# EAGLE design untitled (EAGLE 8.7.1)
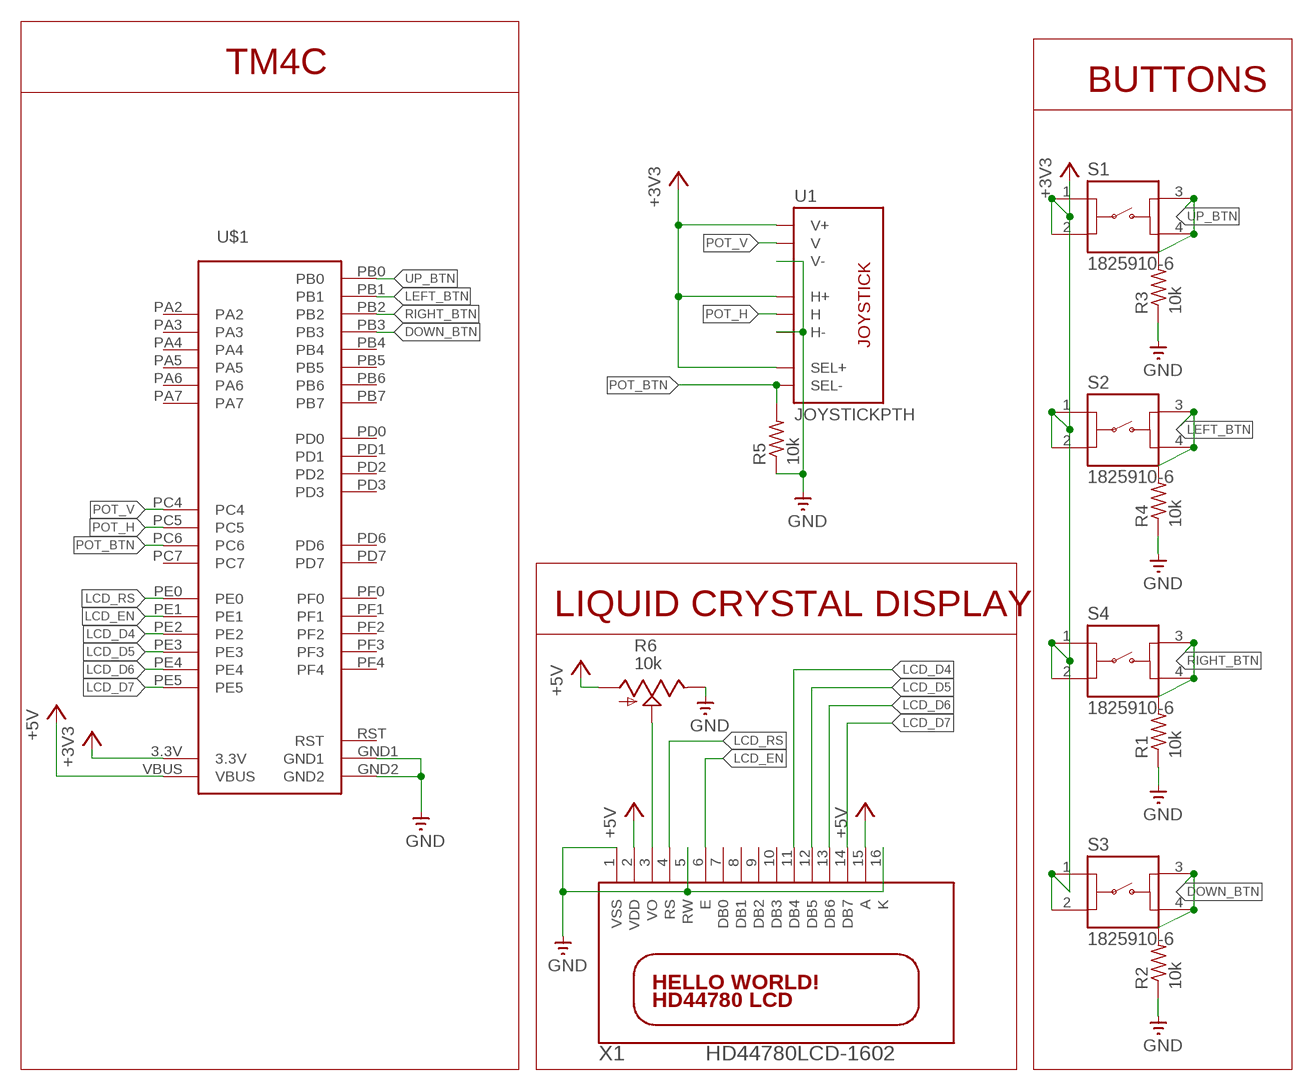
[diagram p0: schematic, sheet 1]

## Parts
R1  10k  R-US_R0805  [R0805]
R2  10k  R-US_R0805  [R0805]
R3  10k  R-US_R0805  [R0805]
R4  10k  R-US_R0805  [R0805]
R5  10k  R-US_R0805  [R0805]
R6  10k  TRIM_US-S64W  [S64W]
S1  1825910-6  [1825910-6]
S2  1825910-6  [1825910-6]
S3  1825910-6  [1825910-6]
S4  1825910-6  [1825910-6]
U1  JOYSTICKPTH  [JOYSTICK]
U$1  STELLARIS-LAUNCHPADSTELLARIS-LAUNCHPAD  [LAUNCHPAD-XL]
X1  HD44780LCD-1602  [LCD1602]

## Nets
+3V3: S1.1 S1.2 S2.1 S2.2 S3.1 S3.2 S4.1 S4.2 U1.B1A(SEL+) U1.H1(H+) U1.V1(V+) U$1.3.3V
+5V: R6.A U$1.VBUS X1.2(VDD) X1.15(A)
DOWN_BTN: R2.2 S3.3 S3.4 U$1.PB3
GND: R1.1 R2.1 R3.1 R4.1 R5.1 R6.E U1.H3(H-) U1.V3(V-) U$1.GND1 U$1.GND2 X1.1(VSS) X1.5(RW) X1.16(K)
LCD_D4: U$1.PE2 X1.11(DB4)
LCD_D5: U$1.PE3 X1.12(DB5)
LCD_D6: U$1.PE4 X1.13(DB6)
LCD_D7: U$1.PE5 X1.14(DB7)
LCD_EN: U$1.PE1 X1.6(E)
LCD_RS: U$1.PE0 X1.4(RS)
LEFT_BTN: R4.2 S2.3 S2.4 U$1.PB1
N$5: R6.S X1.3(VO)
POT_BTN: R5.2 U1.B2A(SEL-) U$1.PC6
POT_H: U1.H2(H) U$1.PC5
POT_V: U1.V2(V) U$1.PC4
RIGHT_BTN: R1.2 S4.3 S4.4 U$1.PB2
UP_BTN: R3.2 S1.3 S1.4 U$1.PB0
Unconnected: U$1.PA2 U$1.PA3 U$1.PA4 U$1.PA5 U$1.PA6 U$1.PA7 U$1.PB4 U$1.PB5 U$1.PB6 U$1.PB7 U$1.PC7 U$1.PD0 U$1.PD1 U$1.PD2 U$1.PD3 U$1.PD6 U$1.PD7 U$1.PF0 U$1.PF1 U$1.PF2 U$1.PF3 U$1.PF4 X1.7(DB0) X1.8(DB1) X1.9(DB2) X1.10(DB3)

## Notes on the sheet
- TM4C
- BUTTONS
- LIQUID CRYSTAL DISPLAY

## Power pins joined to a net without a drawn wire
RST: U$1.RST

## Library data of the parts
R1-R5 = adafruit:R-US_: RESISTOR, American symbol
R6 = pot:TRIM_US-: POTENTIOMETER
S1-S4 = Switch:1825910-6: SWITCH TACTILE SPST-NO 0.05A 24V Manufacturer's datasheet <https://www.te.com/commerce/DocumentDelivery/DDEController?Action=srchrtrv&DocNm=1825910&DocType=Customer+Drawing&DocLang=English>; CREATED_BY: PCBLayout.com; DIGIKEY_PART_NUMBER: 450-1650-ND; MANUFACTURER: TE Connectivity ALCOSWITCH Switches; MPN: 1825910-6
U1 = adafruit:JOYSTICK: Thumb Joystick Joystick commonly found in PS2 controllers. Two pots and a select switch. Adapted from Sparkfun Library (but for more common 6mm switch sticks)
U$1 = fabhack:STELLARIS-LAUNCHPAD: Stellaris Launchpad LM4F120 using all header pins to connect to XL booster packs.
X1 = adafruit:HD44780LCD: HD44780 LCD Standard character type LCDs, available in sizes from 8x1 to 40x4!; SPICEPREFIX: X

## Board
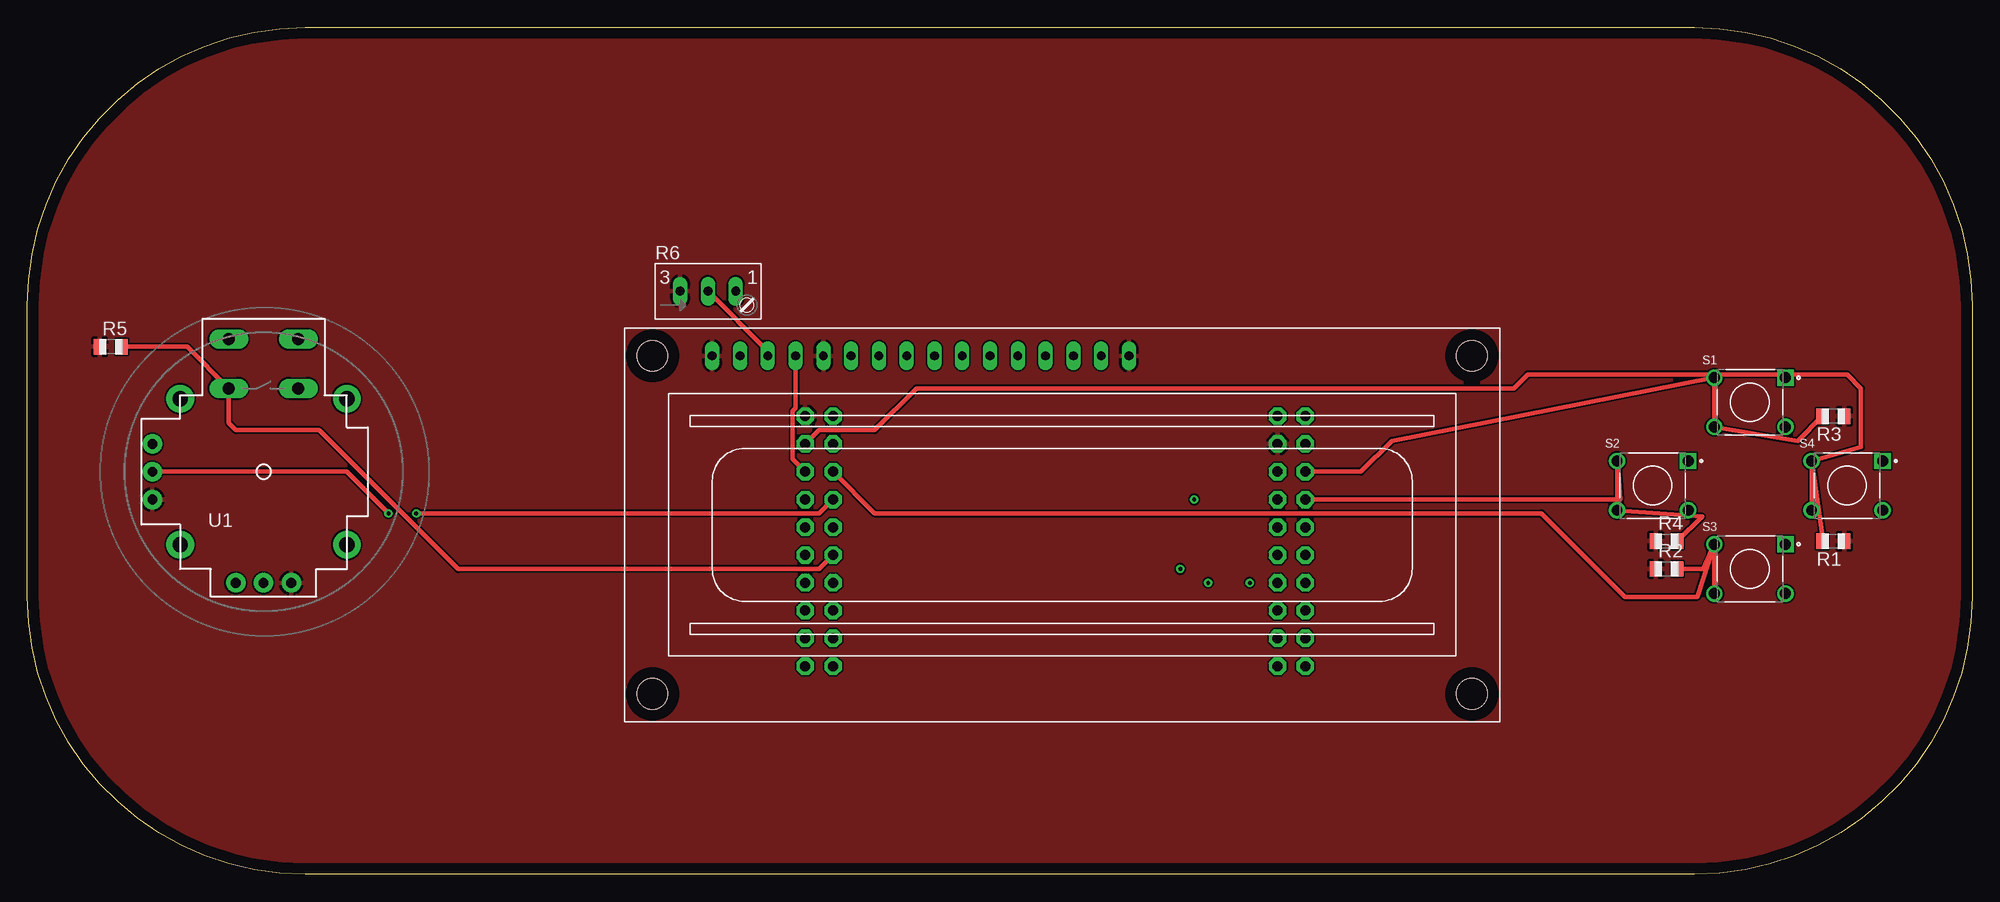
[diagram p1: board, top side]
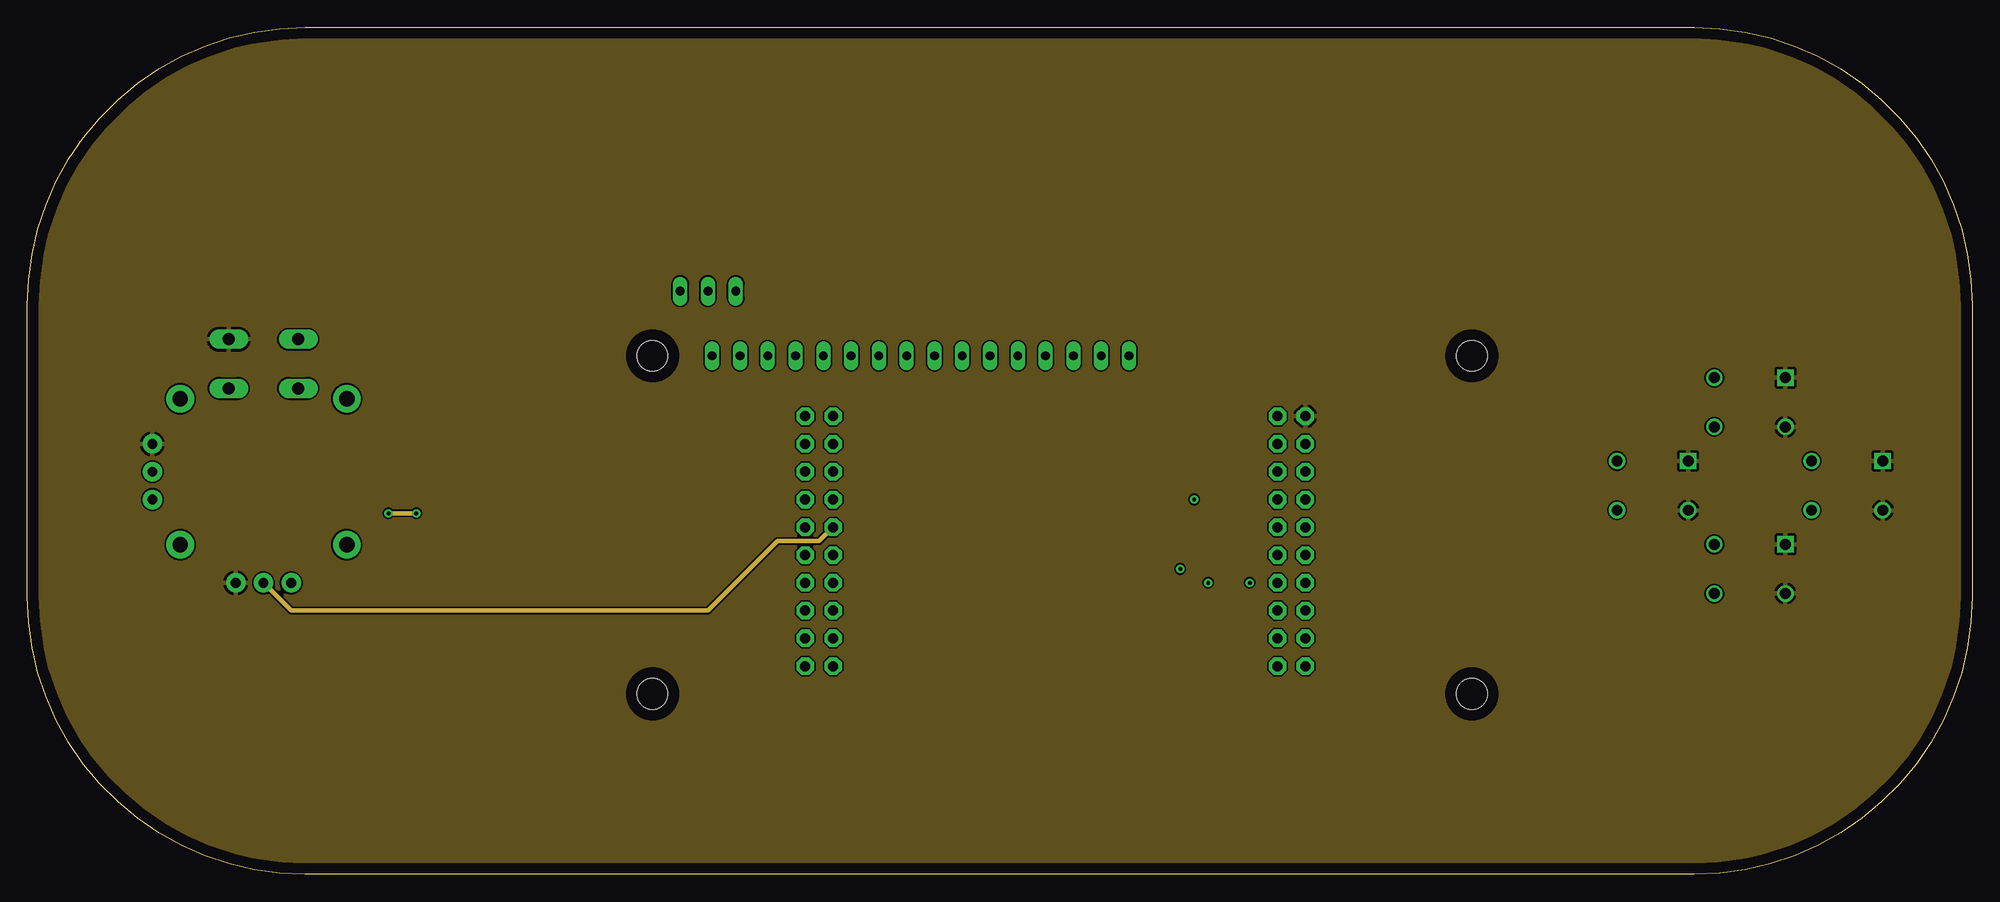
[diagram p2: board, inner layer Route2]
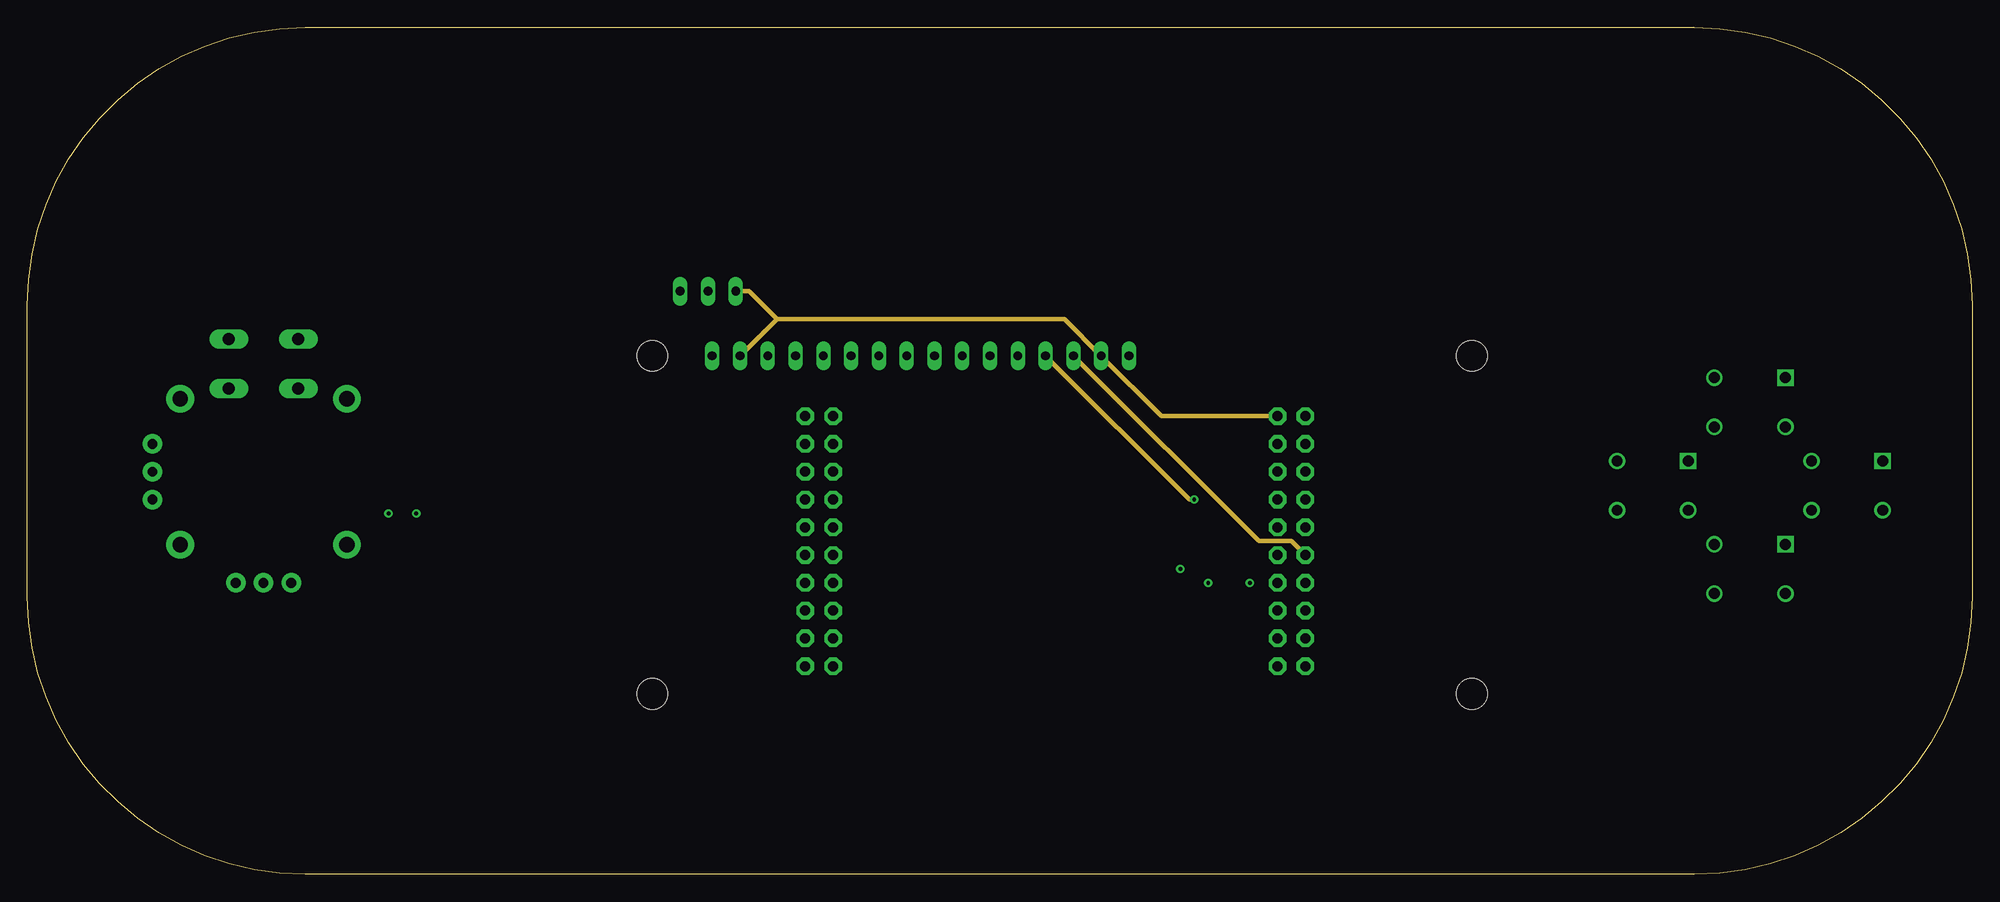
[diagram p3: board, inner layer Route3]
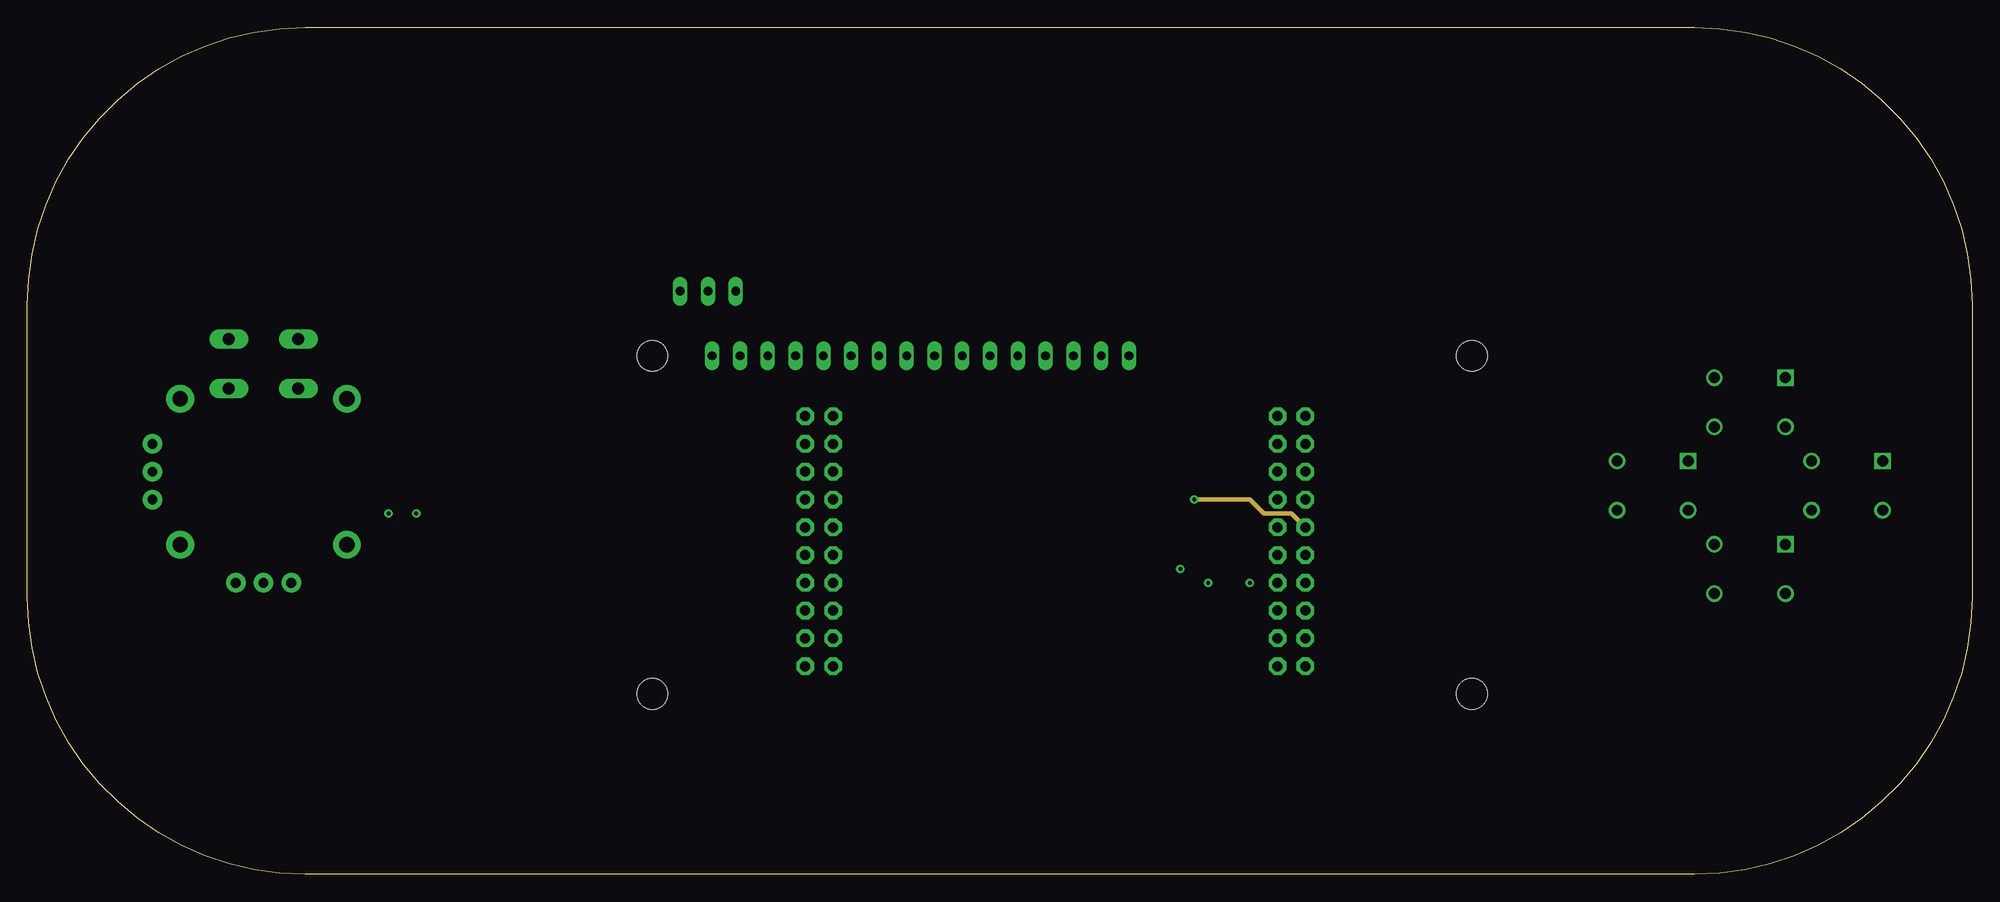
[diagram p4: board, inner layer Route4]
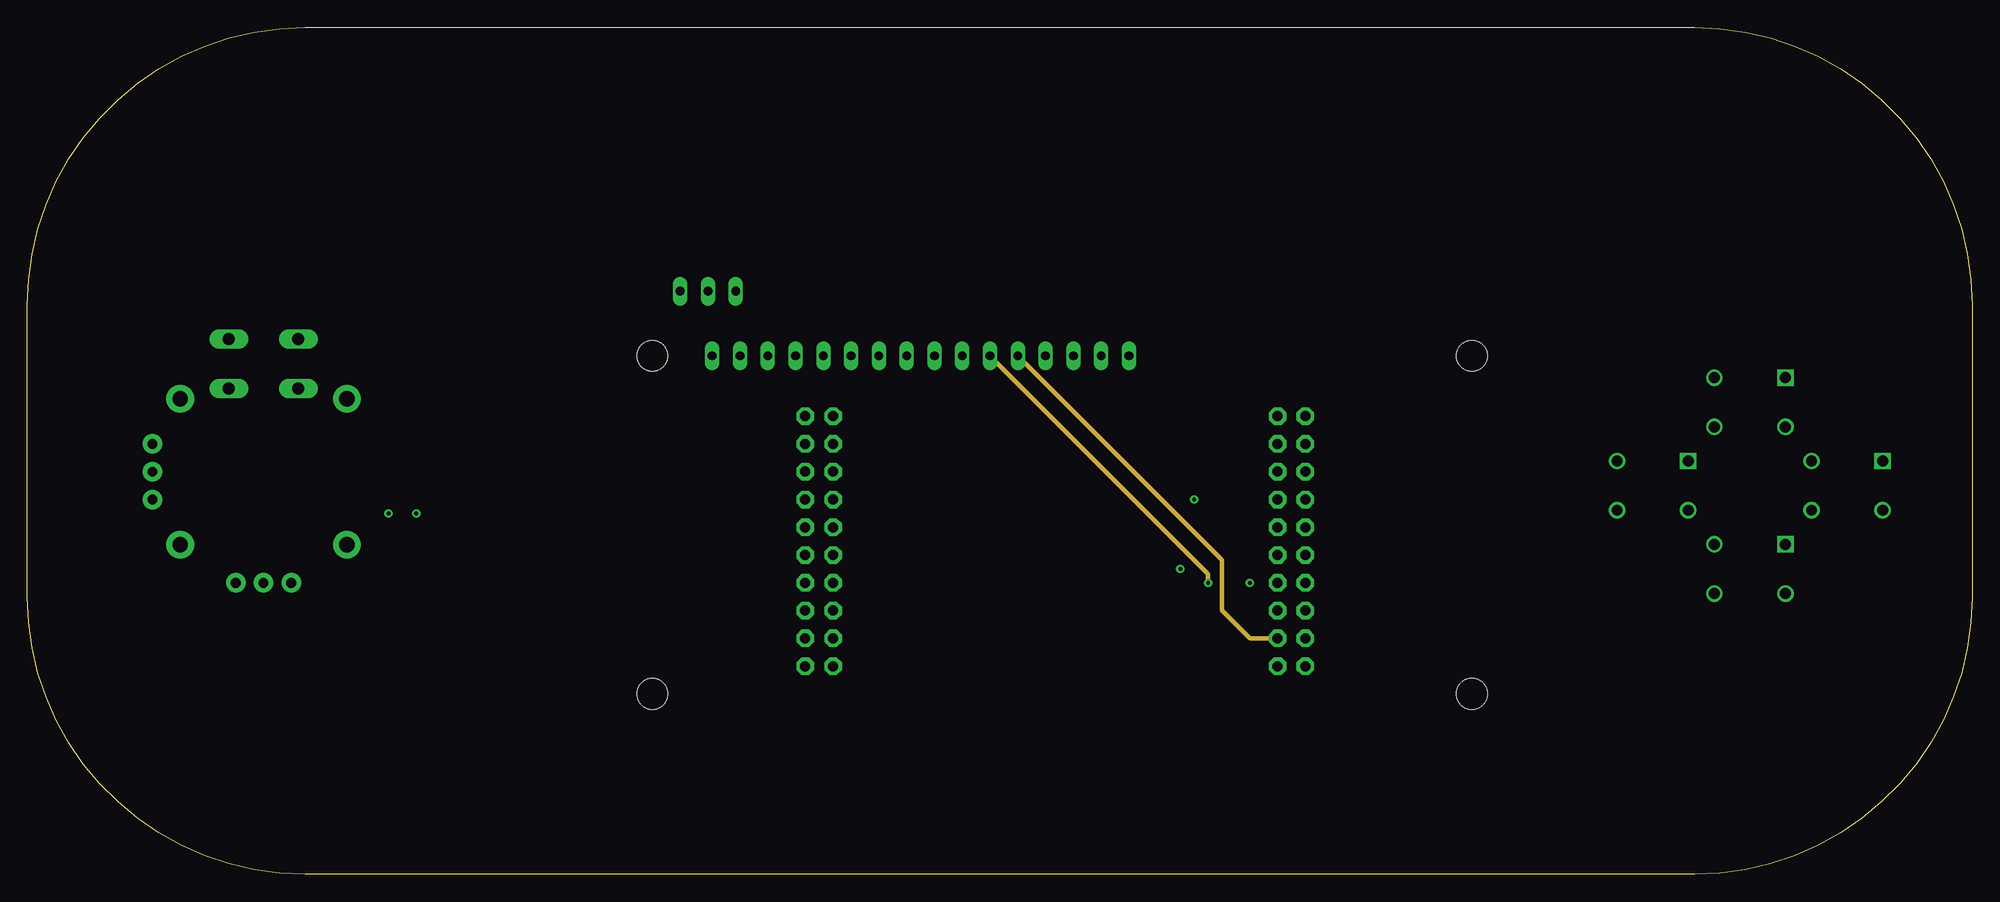
[diagram p5: board, inner layer Route5]
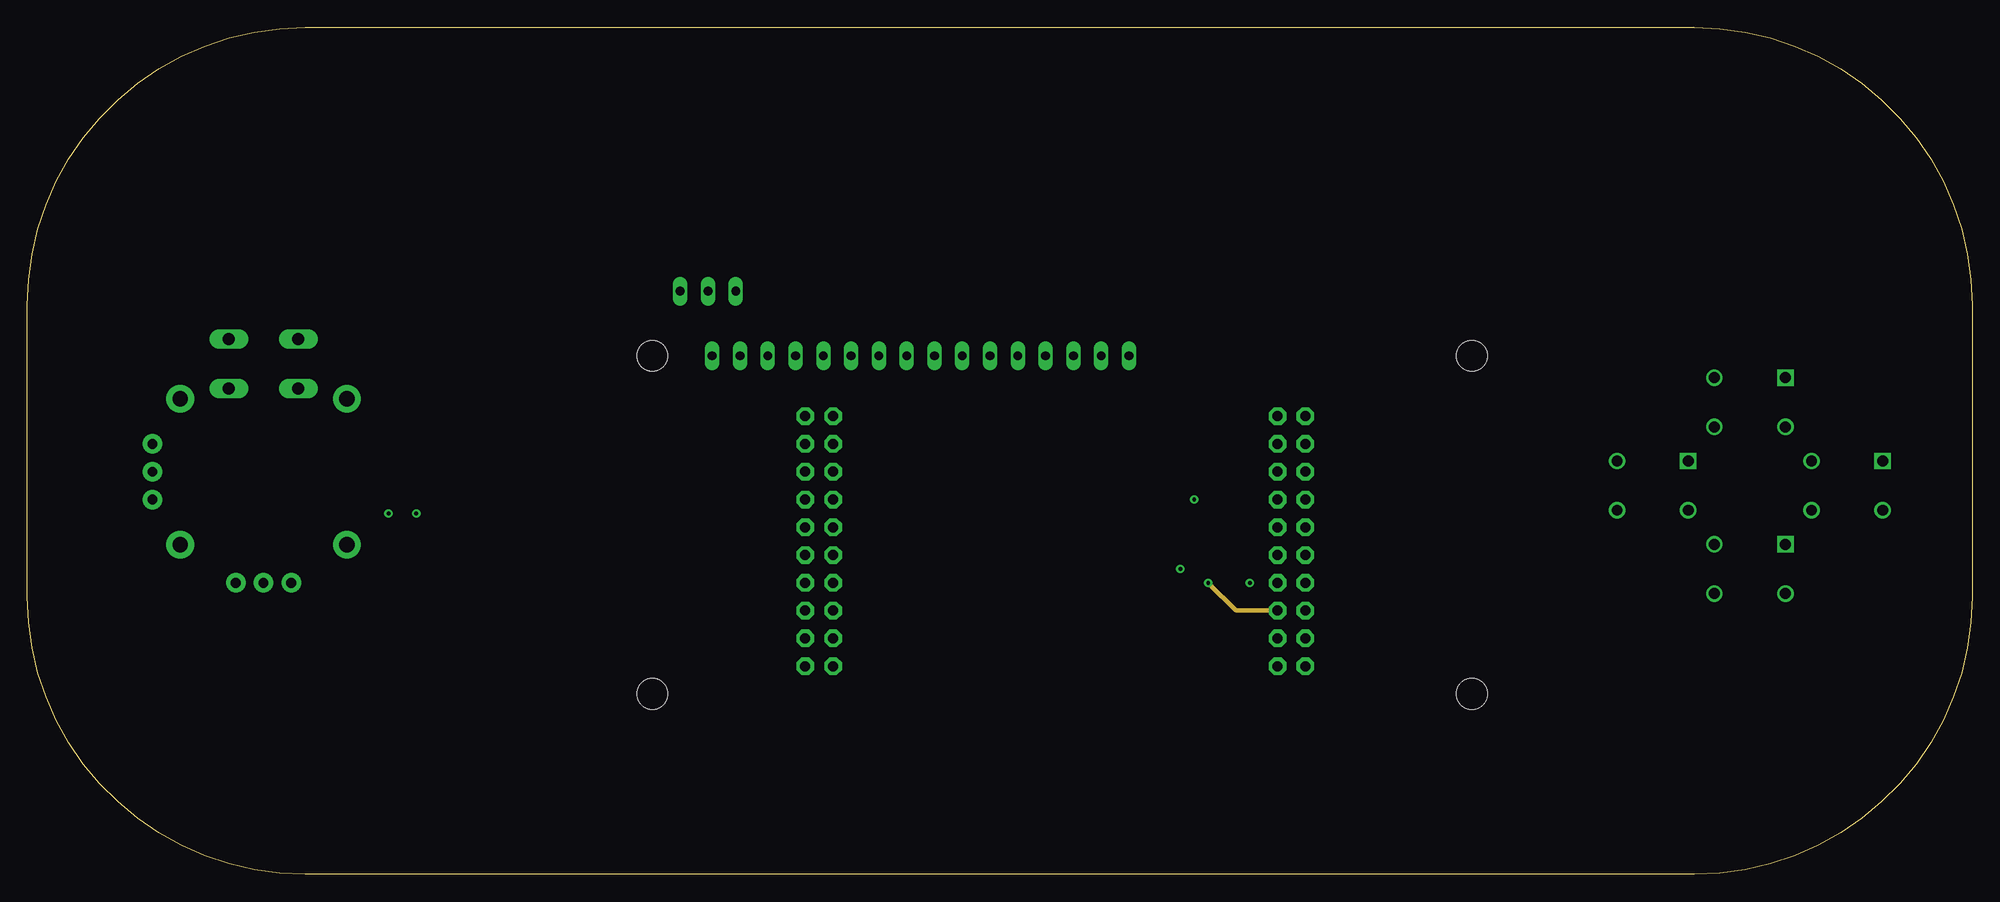
[diagram p6: board, inner layer Route6]
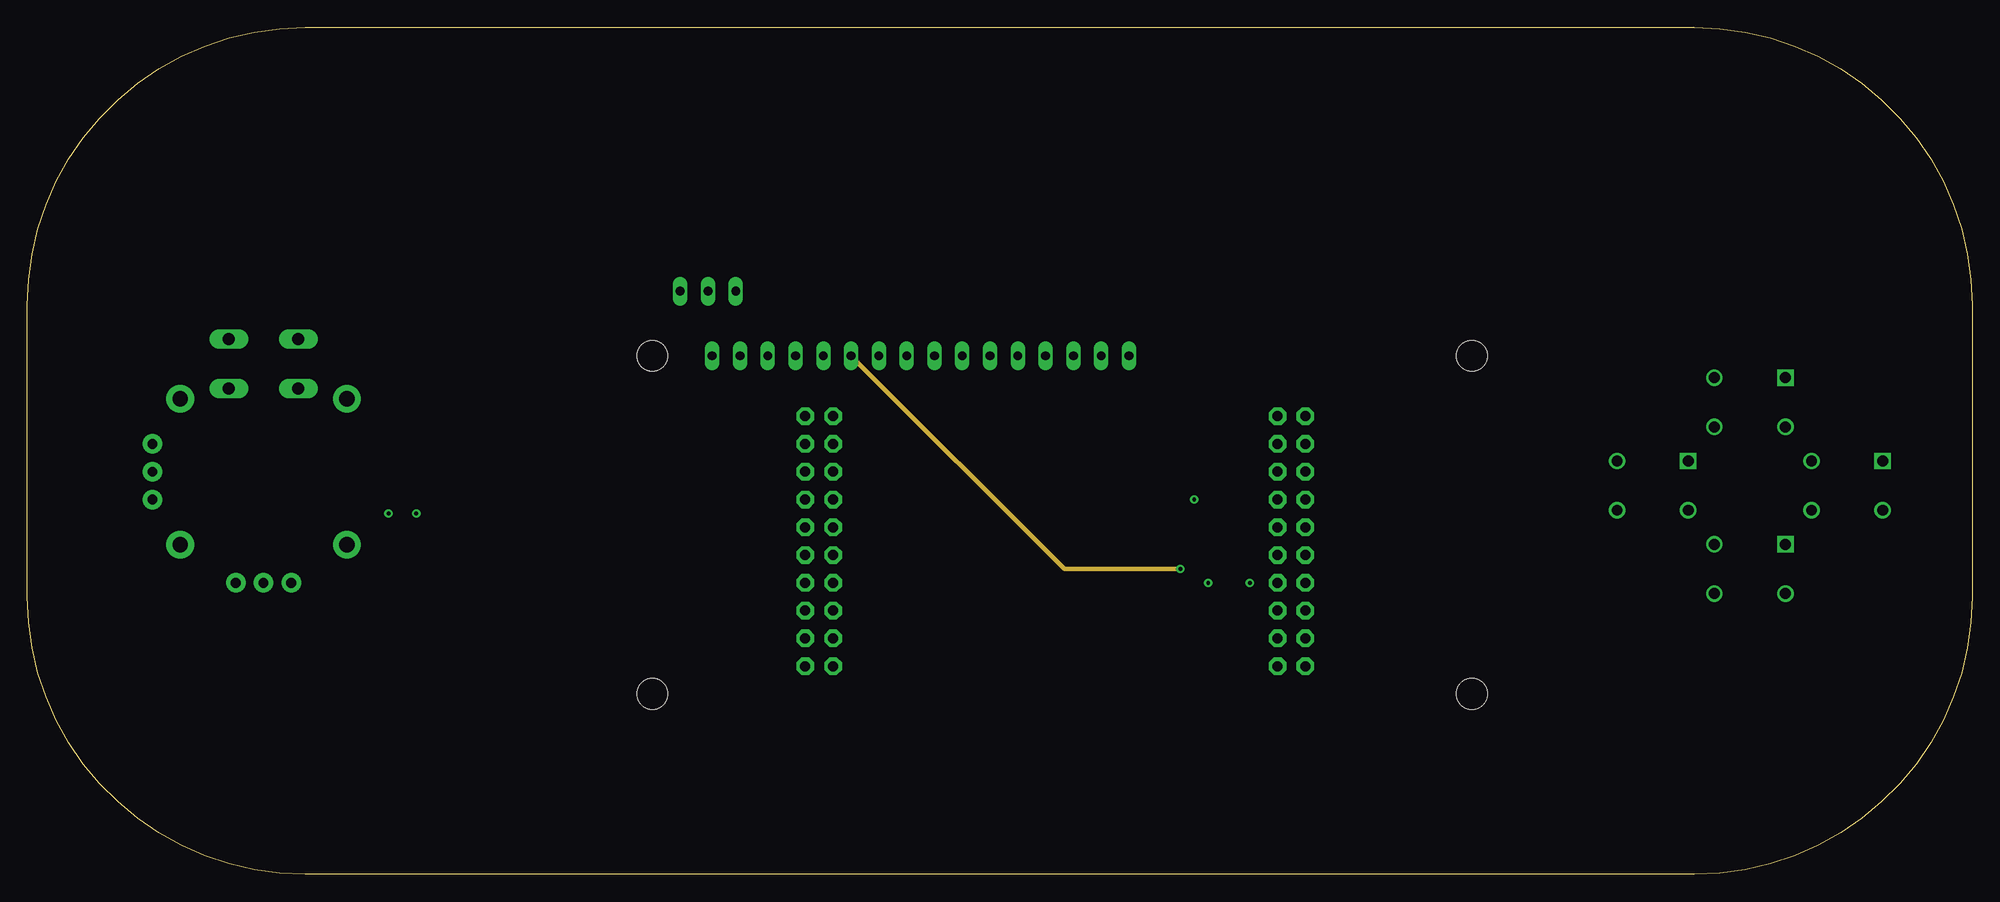
[diagram p7: board, inner layer Route7]
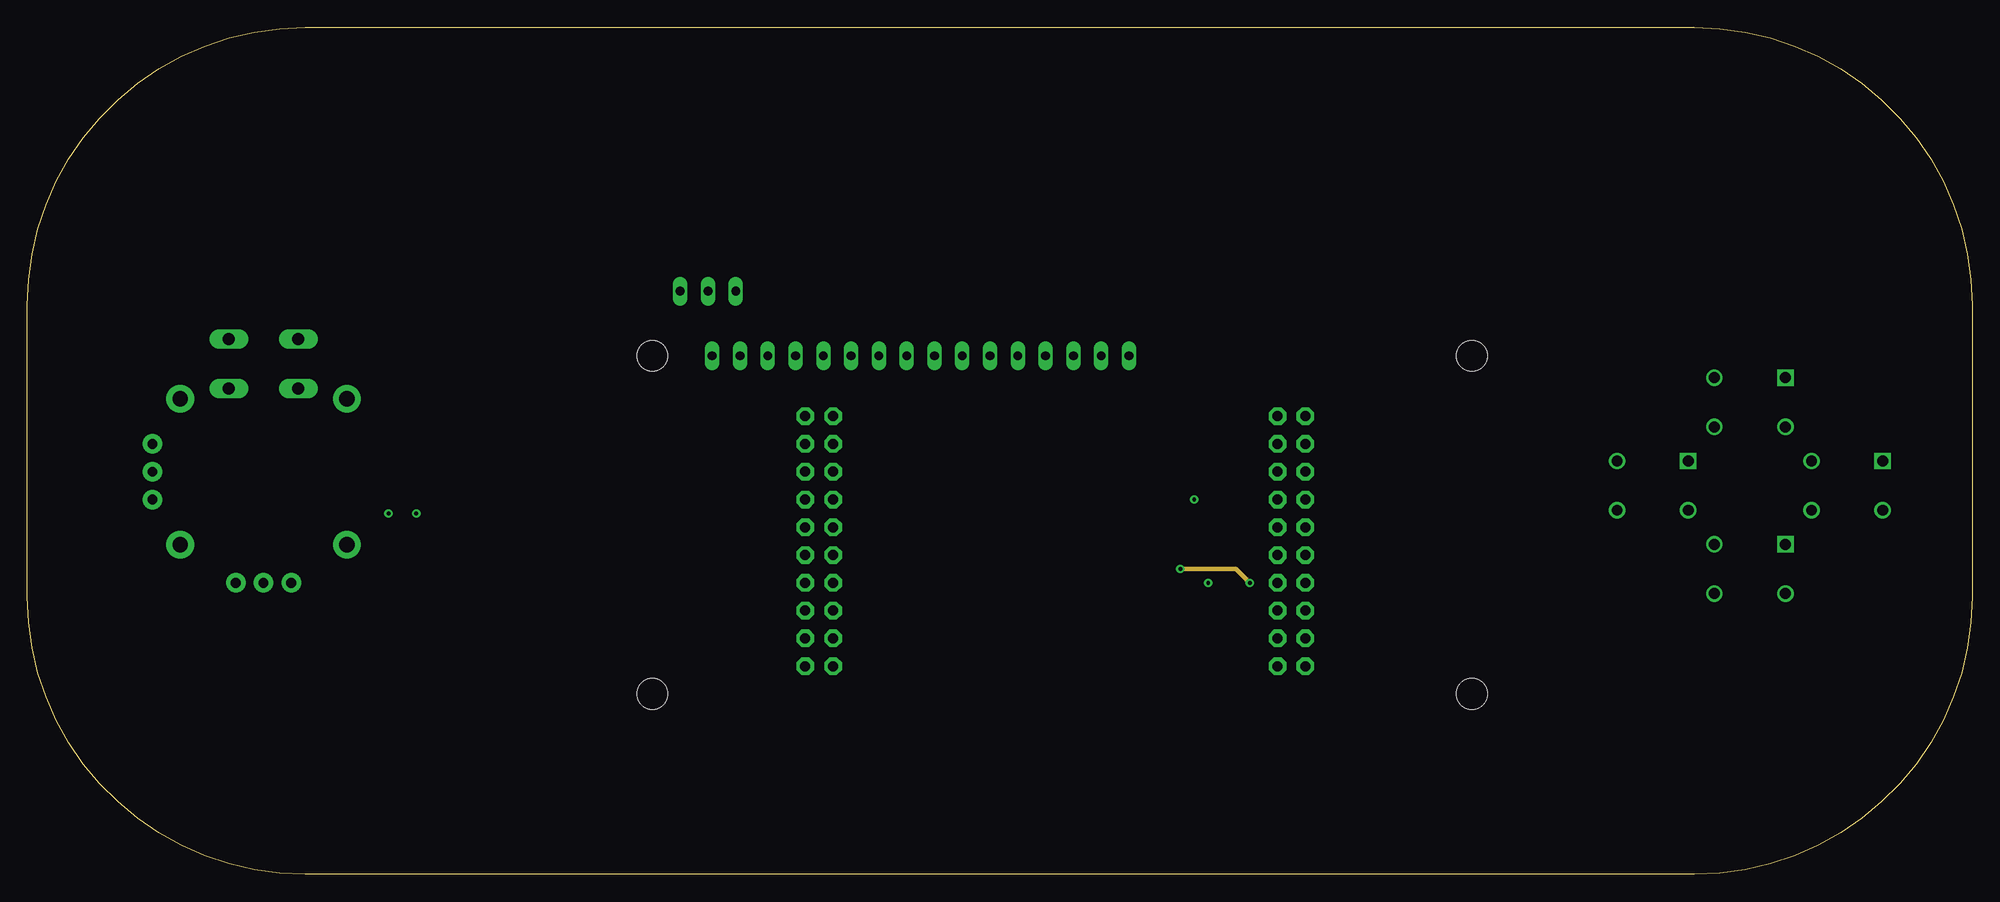
[diagram p8: board, inner layer Route8]
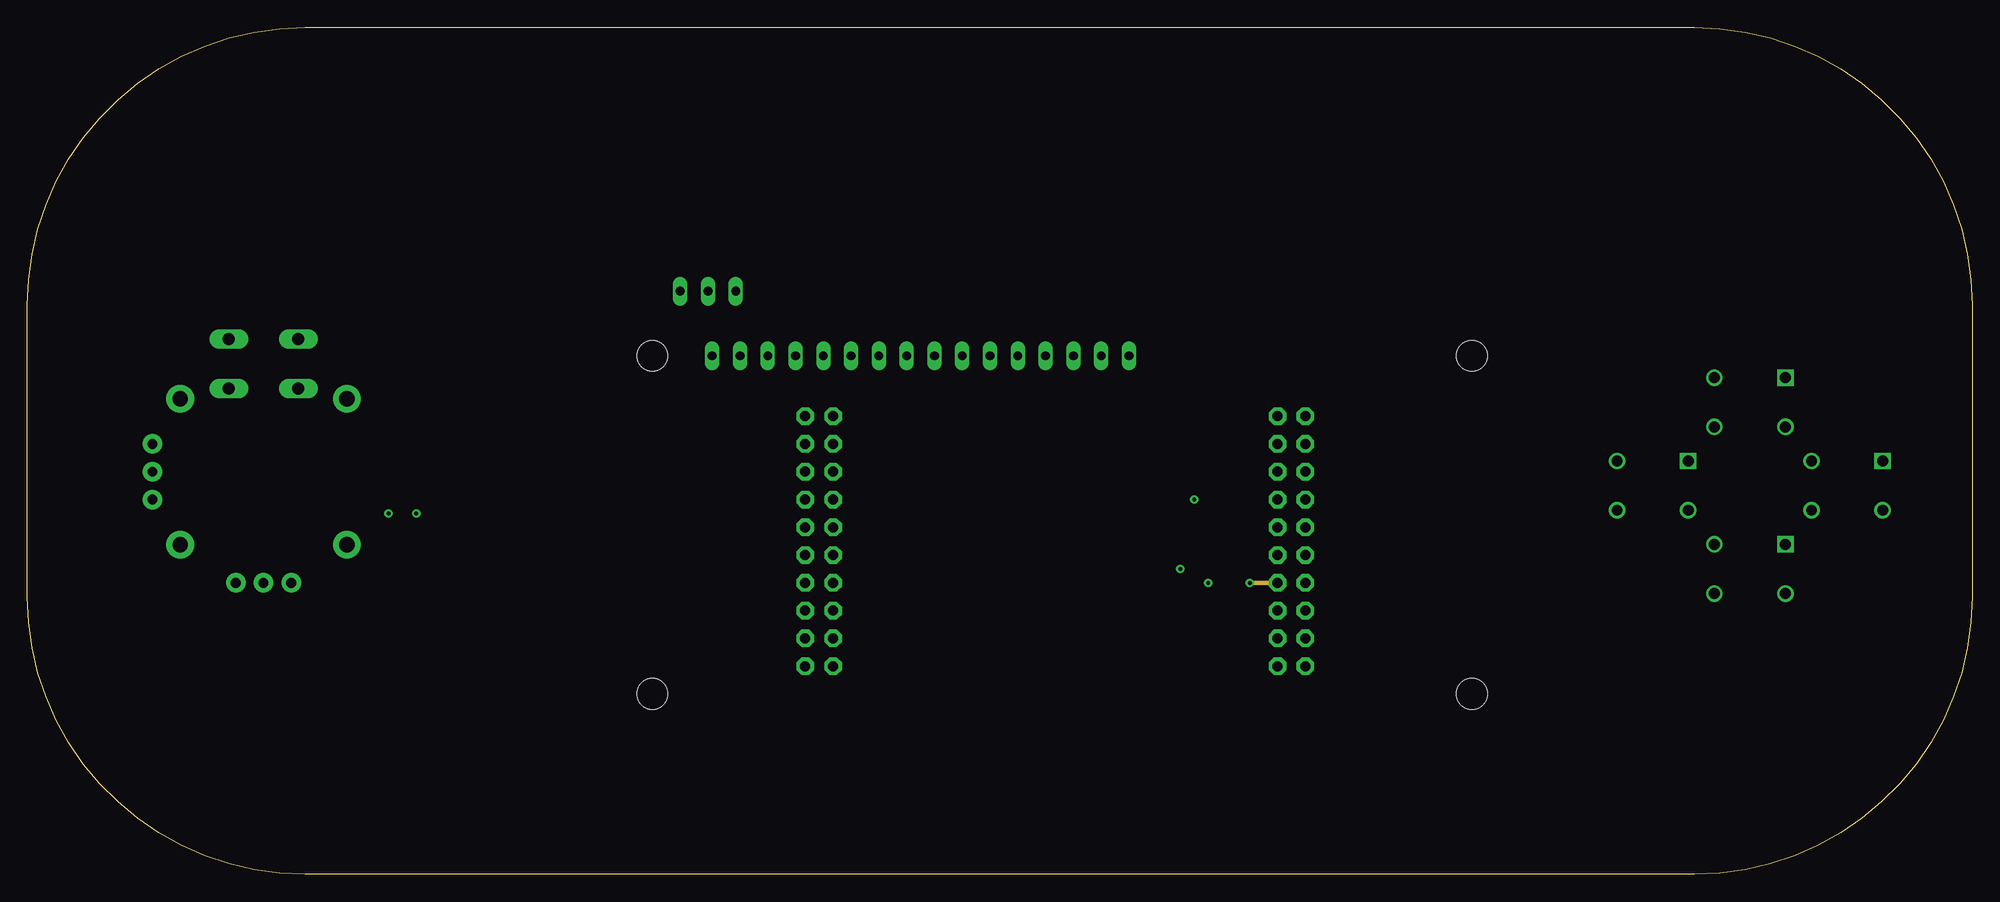
[diagram p9: board, inner layer Route9]
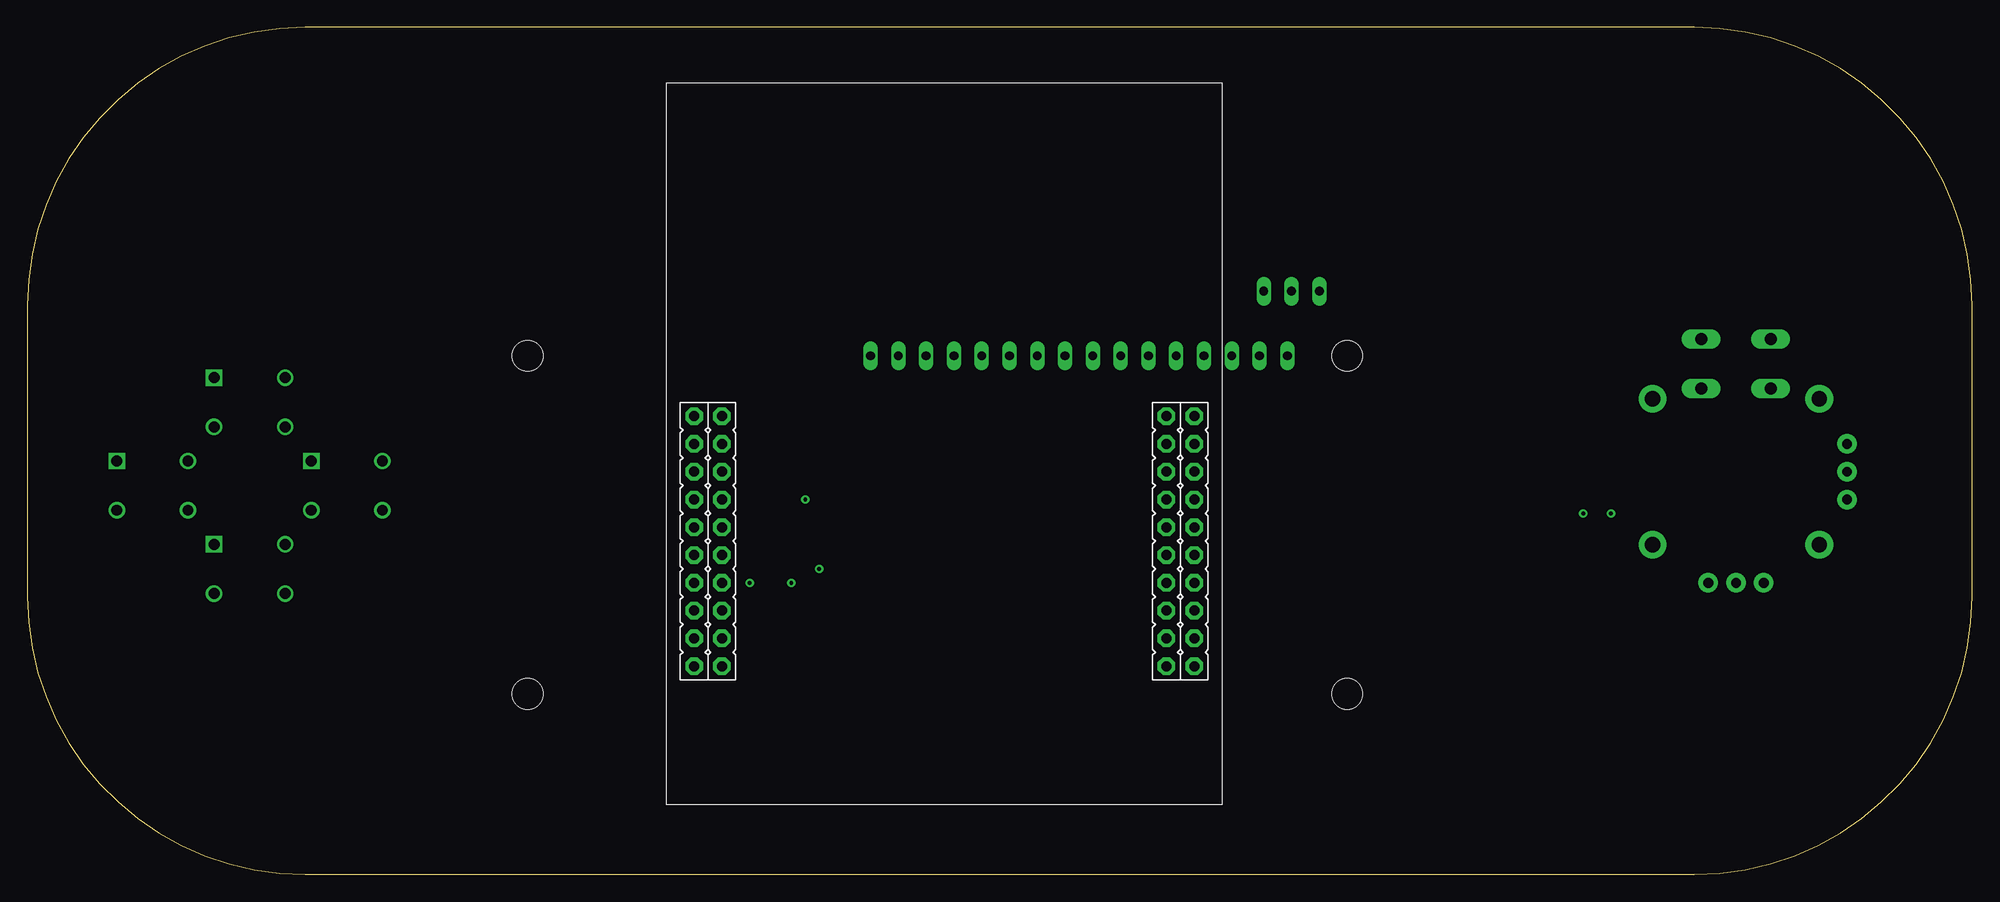
[diagram p10: board, bottom side, seen from below]

Size 177.8 x 77.47 mm. Coordinates in mm from the lower left corner, seen from the top.
Outline: 25.4,77.47 152.4,77.47 arc-90 177.8,52.07 177.8,25.4 arc-90 152.4,0 25.4,0 arc-90 0,25.4 0,52.07 arc-90 25.4,77.47
Copper layers (1*16): Top 0.035mm / dielectric 1.5mm / Bottom 0.035mm
Design rules "default": minimum track width 6mil, minimum drill 0.35mm, track to track 6mil, track to pad 6mil, pad to pad 6mil, via to via 6mil, smd to smd 6mil, copper to edge 40mil, drill to drill 6mil, minimum pad ring 10mil, minimum via ring 8mil, stop-mask expansion 4mil, vias tented up to drill 0mil, thermal gap 10mil

### Footprints (pad centres in the part's own frame; a part is rotated, then mirrored left to right if it is on the bottom)
R0805 = smd 1.1 x 1.4: 1 -1,0; 2 1,0
S64W = drill 0.813 long: A 2.54,1.27; E -2.54,1.27; S 0,1.27
1825910-6 = drill 0.99 square: 1 3.25,2.25 | drill 0.99: 2 3.25,-2.25; 3 -3.25,2.25; 4 -3.25,-2.25
JOYSTICK = drill 1.1 pad 1.778 long: B1A -3.175,12.12; B1B 3.175,12.12; B2A -3.175,7.62; B2B 3.175,7.62 | drill 0.889 pad 1.778: H1 -2.54,-10.16; H2 0,-10.16; H3 2.54,-10.16; V1 -10.16,2.54; V2 -10.16,0; V3 -10.16,-2.54 | drill 1.397 pad 2.54: MOUNT1 -7.62,6.668; MOUNT2 -7.62,-6.668; MOUNT3 7.62,-6.668; MOUNT4 7.62,6.668
LAUNCHPAD-XL = drill 0.914 pad 1.6 octagon: 3.3V 30.48,2.54; GND1 33.02,5.08; GND2 30.48,48.26; PA2 53.34,48.26; PA3 50.8,48.26; PA4 48.26,48.26; PA5 48.26,2.54; PA6 50.8,2.54; PA7 53.34,2.54; PB0 35.56,2.54; PB1 38.1,2.54; PB2 33.02,48.26; PB3 35.56,45.72; PB4 45.72,2.54; PB5 33.02,2.54; PB6 45.72,48.26; PB7 43.18,48.26; PC4 38.1,45.72; PC5 40.64,45.72; PC6 43.18,45.72; PC7 45.72,45.72; PD0 35.56,5.08; PD1 38.1,5.08; PD2 40.64,5.08; PD3 43.18,5.08; PD6 48.26,45.72; PD7 50.8,45.72; PE0 35.56,48.26; PE1 45.72,5.08; PE2 48.26,5.08; PE3 50.8,5.08; PE4 40.64,2.54; PE5 43.18,2.54; PF0 38.1,48.26; PF1 53.34,5.08; PF2 30.48,45.72; PF3 33.02,45.72; PF4 53.34,45.72; RST 40.64,48.26; VBUS 30.48,5.08
LCD1602 = drill 0.8 long: 1 8,33.46; 2 10.54,33.46; 3 13.08,33.46; 4 15.62,33.46; 5 18.16,33.46; 6 20.7,33.46; 7 23.24,33.46; 8 25.78,33.46; 9 28.32,33.46; 10 30.86,33.46; 11 33.4,33.46; 12 35.94,33.46; 13 38.48,33.46; 14 41.02,33.46; 15 43.56,33.46; 16 46.1,33.46 | hole 2.8: 2.54,2.54; 2.54,33.46; 77.46,33.46; 77.46,2.54

### Placement (x,y rotation side)
R1  165.1,30.48 180 top
R2  149.86,27.94 0 top
R3  165.1,41.91 180 top
R4  149.86,30.48 0 top
R5  7.62,48.26 0 top
R6  62.23,52.07 0 top
S1  157.48,43.18 0 top
S2  148.59,35.56 0 top
S3  157.48,27.94 0 top
S4  166.37,35.56 0 top
U1  21.59,36.83 0 top
U$1  119.38,72.39 270 bottom
X1  54.61,13.97 0 top

### Tracks (layer width: path | path; a pad name or v marks a point on that pad's centre or on a via)
+3V3
  pour Route2: -3.81,85.09 -3.81,-7.62 33.02,-7.62 184.15,-7.62 184.15,85.09
+5V
  Route3 0.406: U$1.VBUS 103.69,41.91 X1.15 94.8,50.8 68.52,50.8 | 68.52,50.8 X1.2 | 68.52,50.8 65.98,53.34 R6.A
DOWN_BTN
  Top 0.406: U$1.PB3 77.47,33.02 138.43,33.02 146.05,25.4 152.68,25.4 S3.3 | S3.3 153.24,27.94 R2.2 | S3.4 S3.3
GND
  pour Top: -1.27,82.55 -1.27,-5.08 180.34,-5.08 180.34,82.55
LCD_D4  (via drill 0.35)
  Route5 0.406: X1.11 107.95,27.49 v107.95,26.67
  Route6 0.406: v107.95,26.67 110.49,24.13 U$1.PE2
LCD_D5
  Route5 0.406: X1.12 109.22,28.76 109.22,24.13 111.76,21.59 U$1.PE3
LCD_D6  (via drill 0.35)
  Route3 0.406: X1.13 106.23,34.29 v106.68,34.29
  Route4 0.406: v106.68,34.29 111.76,34.29 113.03,33.02 115.57,33.02 U$1.PE4
LCD_D7
  Route3 0.406: X1.14 112.58,30.48 115.57,30.48 U$1.PE5
LCD_EN  (via drill 0.35)
  Route7 0.406: X1.6 94.8,27.94 v105.41,27.94
  Route8 0.406: v105.41,27.94 110.49,27.94 v111.76,26.67
  Route9 0.406: v111.76,26.67 U$1.PE1
LCD_RS
  Top 0.406: X1.4 70.23,42.65 69.96,42.39 69.96,37.99 U$1.PE0
LEFT_BTN
  Top 0.406: R4.2 153.11,32.73 S2.4 S2.3 145.62,34.29 U$1.PB1
N$5
  Top 0.406: R6.S 67.69,47.88 X1.3
POT_BTN
  Top 0.406: U$1.PC6 72.39,27.94 39.37,27.94 26.67,40.64 19.05,40.64 18.41,41.27 U1.B2A 14.61,48.26 R5.2
POT_H
  Route2 0.406: U1.H2 24.13,24.13 62.23,24.13 68.58,30.48 72.39,30.48 U$1.PC5
POT_V  (via drill 0.35)
  Top 0.406: U$1.PC4 72.39,33.02 v35.56,33.02 | v33.02,33.02 29.21,36.83 U1.V2
  Route2 0.406: v35.56,33.02 v33.02,33.02
RIGHT_BTN
  Top 0.406: S4.3 164.1,31.05 R1.2 | S4.3 S4.4 | S4.3 167.64,39.09 167.64,44.45 166.37,45.72 137.16,45.72 135.89,44.45 81.28,44.45 77.47,40.64 72.39,40.64 U$1.PB2
UP_BTN
  Top 0.406: R3.2 161.84,39.65 S1.4 S1.3 124.74,39.65 121.92,36.83 U$1.PB0